# Altium project 指纹密码锁工程（原理图、pcb）.PrjPcb
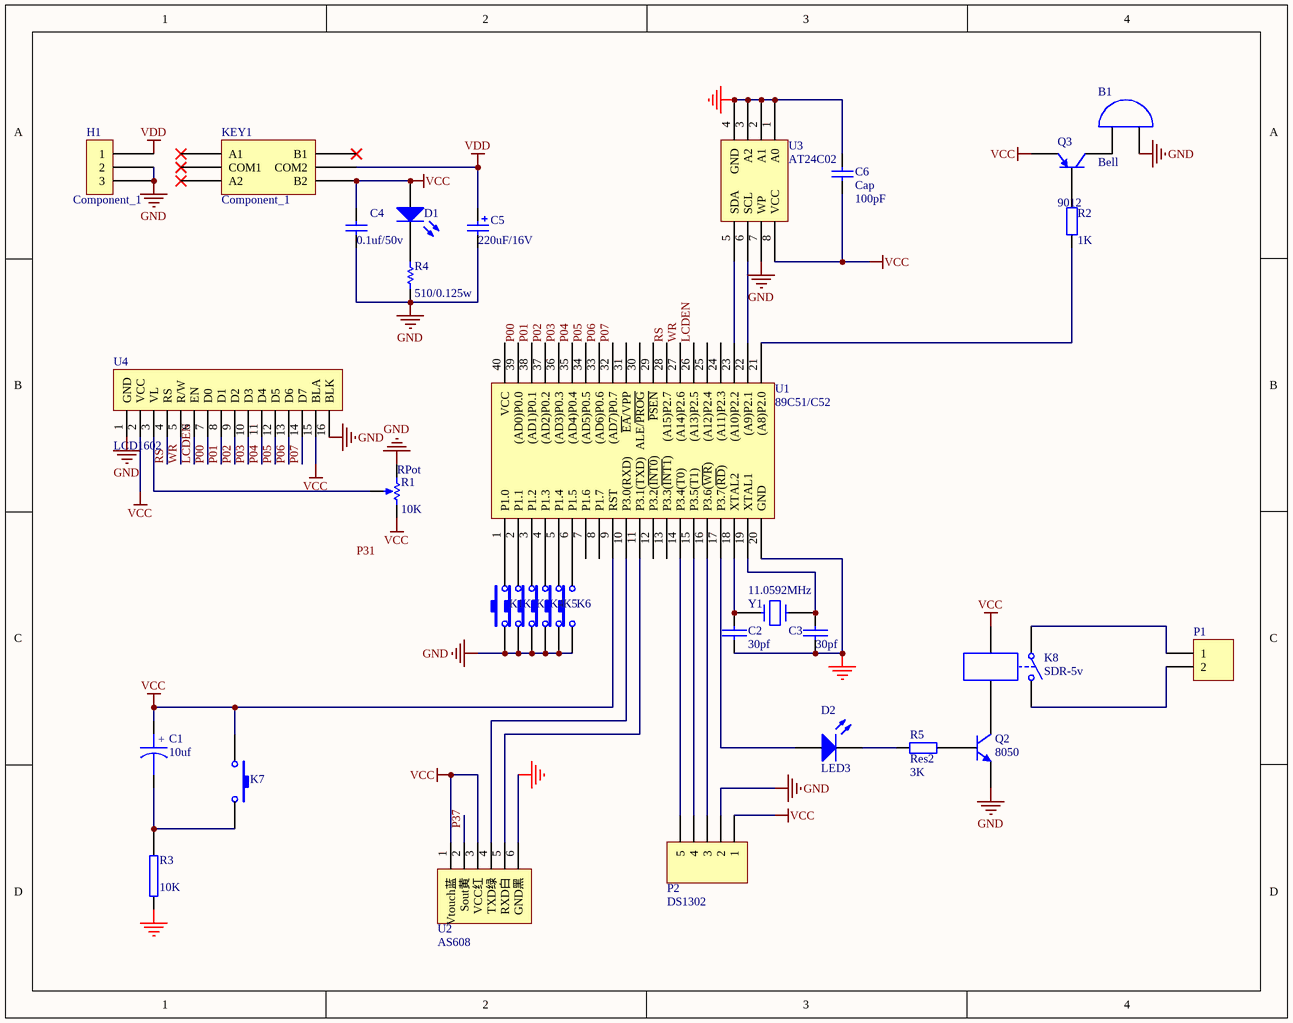
[diagram p0: 指纹锁原理图.schdoc]
1 sheet, 33 parts. Net scope: global (net labels, ports and power ports of the same name join across sheets).
Board file: 指纹锁pcb图.PcbDoc

## Sheet 指纹锁原理图.schdoc: AT long bus (13.3 x 4.2 inches)
size A; Organization: Organization; Address1: Address1; Address2: Address2; Address3: Address3; Address4: Address4; DocumentNumber: 1; Revision: 0; SheetNumber: 2; SheetTotal: 2

### Parts
B1  Bell  [PIN2]
C1  10uf  [C0805]
C2  30pf  [C0805]
C3  30pf  [C0805]
C4  value 0.1uf/50v  [RAD-0.3]  (hidden comment: Cap)
C5  value 220uF/16V  [Capacitor-Disk-Middle]  (hidden comment: Cap Pol2)
C6  Cap  value 100pF  [RAD-0.3]
D1  LED Chip  [CLED1005-0402]  (value not drawn)
D2  LED3  [3.5X2.8X1.9]
H1  Component_1  [HDR1X3]
K1  Button  [BUTTON-DIP]  (value not drawn)
K2  Button  [BUTTON-DIP]  (value not drawn)
K3  Button  [BUTTON-DIP]  (value not drawn)
K4  Button  [BUTTON-DIP]  (value not drawn)
K5  Button  [BUTTON-DIP]  (value not drawn)
K6  Button  [BUTTON-DIP]  (value not drawn)
K7  Button  [BUTTON-DIP]  (value not drawn)
K8  SDR-5v  [MODULE4]
KEY1  Component_1  [HDR2X3]
P1  (no value)  [MHDR1X2]
P2  DS1302  [MHDR1X5]
Q2  8050  [SOT-23B_N]
Q3  9012  [TO-92A]
R1  RPot  value 10K  [VR5]
R2  value 1K  [AXIAL-0.4]
R3  10K  [RAD-0.1]
R4  value 510/0.125w  [AXIAL-0.3]  (hidden comment: Res1)
R5  Res2  value 3K  [AXIAL-0.4]
U1  89C51/C52  [DIP-40]
U2  AS608  [SIP-6]
U3  AT24C02  [DIP8]
U4  LCD1602  [LCD1602]
Y1  11.0592MHz  [XTAL-49/U_N]

### Nets
GND: B1.2(B) C2.2 C3.2 C4.1 C5.2 C6.2 H1.2 H1.3 K1.2 K2.2 K3.2 K4.2 K5.2 K6.2 P2.2 Q2.3(E) R1.1(TOP) R4.1 U1.20(GND) U2.6(GND黑) U3.1(A0) U3.2(A1) U3.3(A2) U3.4(GND) U3.7(WP) U4.1(GND) U4.16(BLK)
VCC: C1.2 C4.2 C6.1 D1.1(A) K7.2 K8.3 KEY1.6(B2) P2.1 Q3.1(E) R1.2(BOT) U1.9(RST) U2.1(Vtouch蓝) U2.3(VCC红) U3.8(VCC) U4.2(VCC) U4.15(BLA)
VDD: C5.1 H1.1 KEY1.5(COM2)
LCDEN: U1.26((A13)P2.5) U4.6(EN)
P00: U1.39((AD0)P0.0) U4.7(D0)
P01: U1.38((AD1)P0.1) U4.8(D1)
P02: U1.37((AD2)P0.2) U4.9(D2)
P03: U1.36((AD3)P0.3) U4.10(D3)
P04: U1.35((AD4)P0.4) U4.11(D4)
P05: U1.34((AD5)P0.5) U4.12(D5)
P06: U1.33((AD6)P0.6) U4.13(D6)
P07: U1.32((AD7)P0.7) U4.14(D7)
P37: U2.2(Sout黄)
RS: U1.28((A15)P2.7) U4.4(RS)
WR: U1.27((A14)P2.6) U4.5(R/W)
NetB1_1: B1.1(A) Q3.3(C)
NetC1_1: C1.1 K7.1 R3.2
NetC2_1: C2.1 U1.18(XTAL2) Y1.1
NetC3_1: C3.1 U1.19(XTAL1) Y1.2
NetD1_2: D1.2(K) R4.2
NetD2_1: D2.1(A) U1.17(P3.7(~{RD}))
NetD2_2: D2.2(K) R5.1
NetK1_1: K1.1 U1.1(P1.0)
NetK2_1: K2.1 U1.2(P1.1)
NetK3_1: K3.1 U1.3(P1.2)
NetK4_1: K4.1 U1.4(P1.3)
NetK5_1: K5.1 U1.5(P1.4)
NetK6_1: K6.1 U1.6(P1.5)
NetK8_1: K8.1 P1.1
NetK8_2: K8.2 P1.2
NetK8_4: K8.4 Q2.1(C)
NetP2_3: P2.3 U1.16(P3.6(~{WR}))
NetP2_4: P2.4 U1.15(P3.5(T1))
NetP2_5: P2.5 U1.14(P3.4(T0))
NetQ2_2: Q2.2(B) R5.2
NetQ3_2: Q3.2(B) R2.2
NetR1_3: R1.3(TAP) U4.3(VL)
NetR2_1: R2.1 U1.21((A8)P2.0)
NetU1_10: U1.10(P3.0(RXD)) U2.4(TXD绿)
NetU1_11: U1.11(P3.1(TXD)) U2.5(RXD白)
NetU1_22: U1.22((A9)P2.1) U3.6(SCL)
NetU1_23: U1.23((A10)P2.2) U3.5(SDA)

Not connected (* = marked no-connect by the designer): KEY1 1(A1)* 2(COM1)* 3(A2)* 4(B1)*; R3 1; U1 7(P1.6) 8(P1.7) 12(P3.2(~{INT0})) 13(P3.3(~{INT1})) 24((A11)P2.3) 25((A12)P2.4) 29(~{PSEN}) 30(ALE/~{PROG}) 31(~{EA}/VPP) 40(VCC)

### Notes on the sheet
- Labels drawn without touching a wire or pin: GND, P31
- (in symbol 电解电容) +

### Library data of the parts
B1 = Bell: Electrical Bell; Published: 24-Mar-1999; LatestRevisionDate: 17-Jul-2002; LatestRevisionNote: Re-released for DXP Platform.; PackageReference: PIN2; Publisher: Altium Limited
C1 = 电解电容: Capacitor
C2 C3 = CAP: Capacitor
C4 C6 = Cap: Capacitor; Published: 8-Jun-2000; LatestRevisionDate: 17-Jul-2002; LatestRevisionNote: Re-released for DXP Platform.; PackageReference: RAD-0.3; Publisher: Altium Limited; PackageDescription: Radial Cap, Thru-Hole; 2 Leads; 0.3 in Pin Spacing
C5 = Cap Pol2: Polarized Capacitor (Axial); Published: 8-Jun-2000; LatestRevisionDate: 17-Jul-2002; LatestRevisionNote: Re-released for DXP Platform.; PackageReference: POLAR0.8; Publisher: Altium Limited; PackageDescription: Polarized Capacitor; 2 Leads
D1 = LED Chip: Typical Chip LED; Published: 8-Jun-2000; Revision: July-2002: Re-released for DXP Platform.; Publisher: Altium Limited
D2 = LED3: Typical BLUE SiC LED; Published: 8-Jun-2000; LatestRevisionDate: 17-Dec-2003; LatestRevisionNote: PCB Footprint replaced.; DatasheetVersion: 16-Apr-2002; PackageVersion: 16-Apr-2002; PackageReference: 3.5X2.8X1.9; Publisher: Altium Limited; PackageDescription: SM LED; 2 C-Bend Leads; Body 3.5 x 2.8 x 1.9 mm, inc leads (LxWxH typ)
K8 = Relay-SPST: Single-Pole Single-Throw Relay; Published: 24-Mar-1999; LatestRevisionDate: 17-Jul-2002; LatestRevisionNote: Re-released for DXP Platform.; PackageReference: MODULE4; Publisher: Altium Limited
P1 = MHDR1X2: Header, 2-Pin; LatestRevisionDate: 17-Jul-2002; LatestRevisionNote: Re-released for DXP Platform.; Publisher: Altium Limited
P2 = MHDR1X5: Header, 5-Pin; LatestRevisionDate: 17-Jul-2002; LatestRevisionNote: Re-released for DXP Platform.; Publisher: Altium Limited
Q2 = QNPN: NPN Bipolar Transistor; Published: 8-Jun-2000; LatestRevisionDate: 29-May-2009; LatestRevisionNote: IPC-7351 Footprint Added.; PackageVersion: Aug-1999; PackageReference: SOT-23B; Publisher: Altium Limited; PackageDescription: 3-Pin SOT-23 Package 0.95 mm Pitch, 2.4 mm Lead Span
Q3 = 2N3906: PNP General Purpose Amplifier; Published: 8-Jun-2000; LatestRevisionDate: 15-Jan-2003; LatestRevisionNote: PCB Footprint 'BCY-W3/D4.7' replaced; DatasheetVersion: 1997; PackageVersion: Sep-1998; PackageReference: TO-92A; Publisher: Altium Limited; PackageDescription: TO, Flat Index; 3 In-Line, Axial Leads; Body Dia. 4.5mm; Leads 0.51 x 0.48 mm (max); ComponentLink1Description: Manufacturer Link; ComponentLink1URL: http://www.fairchildsemi.com/; ComponentLink2Description: Datasheet; ComponentLink2URL: http://www.fairchildsemi.com/ds/2N%2F2N3906.pdf
R1 = RPot: Potentiometer; Sim Note: Enter the Resistance value and the set point into parameter fields.; Set Position: 0.5; Published: 8-Jun-2000; LatestRevisionDate: 17-Jul-2002; LatestRevisionNote: Re-released for DXP Platform.; PackageReference: VR5; Publisher: Altium Limited; PackageDescription: Variable Resistor, Thru-Hole; 3 Leads
R2 R5 = Res2: Resistor; Published: 8-Jun-2000; LatestRevisionDate: 17-Jul-2002; LatestRevisionNote: Re-released for DXP Platform.; PackageReference: AXIAL-0.4; Publisher: Altium Limited; PackageDescription: Axial Device, Thru-Hole; 2 Leads; 0.4 in Pin Spacing
R3 = RES2
R4 = Res1: Resistor; Published: 8-Jun-2000; LatestRevisionDate: 17-Jul-2002; LatestRevisionNote: Re-released for DXP Platform.; PackageReference: AXIAL-0.3; Publisher: Altium Limited; PackageDescription: Axial Device, Thru-Hole; 2 Leads; 0.3 in Pin Spacing
U1 = AT89C51
U2 = FM608
Y1 = CRYSTAL
K1-K7 = Button: Published: 24-Mar-1999; LatestRevisionDate: 17-Jul-2002; LatestRevisionNote: Re-released for DXP Platform.; PackageReference: SPST-2; Publisher: Altium Limited